# EAGLE design 7-segment (EAGLE 7.5.0)
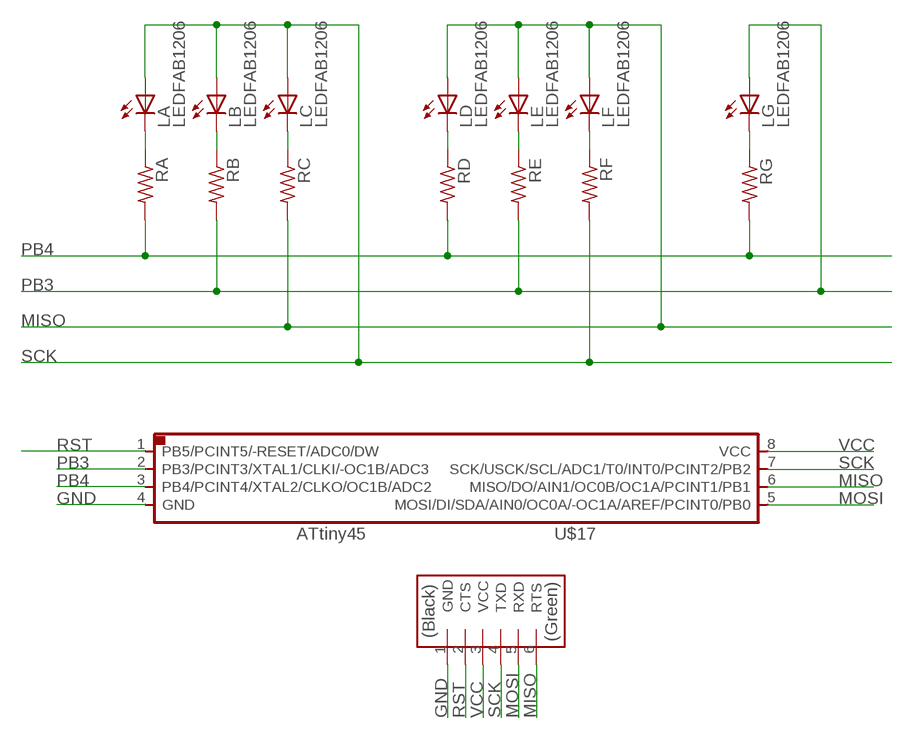
[diagram p0: schematic, sheet 1]

## Parts
LA  LEDFAB1206  [LED1206FAB]
LB  LEDFAB1206  [LED1206FAB]
LC  LEDFAB1206  [LED1206FAB]
LD  LEDFAB1206  [LED1206FAB]
LE  LEDFAB1206  [LED1206FAB]
LF  LEDFAB1206  [LED1206FAB]
LG  LEDFAB1206  [LED1206FAB]
RA  RES-US1206FAB  [R1206FAB]
RB  RES-US1206FAB  [R1206FAB]
RC  RES-US1206FAB  [R1206FAB]
RD  RES-US1206FAB  [R1206FAB]
RE  RES-US1206FAB  [R1206FAB]
RF  RES-US1206FAB  [R1206FAB]
RG  RES-US1206FAB  [R1206FAB]
U$3  FTDI-SMD-HEADER  [1X06SMD]
U$17  ATTINY45SI  [SOIC8]

## Nets
GND: U$3.1(GND) U$17.4(GND)
MISO: LD.1(A) LE.1(A) LF.1(A) RC.2 U$3.6(RTS) U$17.6(MISO/DO/AIN1/OC0B/OC1A/PCINT1/PB1)
MOSI: U$3.5(RXD) U$17.5(MOSI/DI/SDA/AIN0/OC0A/-OC1A/AREF/PCINT0/PB0)
N$2: LA.2(C) RA.1
N$4: LB.2(C) RB.1
N$5: LC.2(C) RC.1
N$6: LD.2(C) RD.1
N$7: LE.2(C) RE.1
N$8: LF.2(C) RF.1
N$11: LG.2(C) RG.1
PB3: LG.1(A) RB.2 RE.2 U$17.2(PB3/PCINT3/XTAL1/CLKI/-OC1B/ADC3)
PB4: RA.2 RD.2 RG.2 U$17.3(PB4/PCINT4/XTAL2/CLKO/OC1B/ADC2)
RST: U$3.2(CTS) U$17.1(PB5/PCINT5/-RESET/ADC0/DW)
SCK: LA.1(A) LB.1(A) LC.1(A) RF.2 U$3.4(TXD) U$17.7(SCK/USCK/SCL/ADC1/T0/INT0/PCINT2/PB2)
VCC: U$3.3(VCC) U$17.8(VCC)

## Library data of the parts
LA LB LC LD LE LF LG = fab:LED: LED
RA RB RC RD RE RF RG = fab:RES-US: Resistor (US Symbol) Variants with postfix FAB are widened to allow the routing of internal traces
U$3 = fab:FTDI-SMD-HEADER
U$17 = fab:ATTINY45

## Net classes
0 default: width 0.457 mm, clearance 1.626 mm

## Board
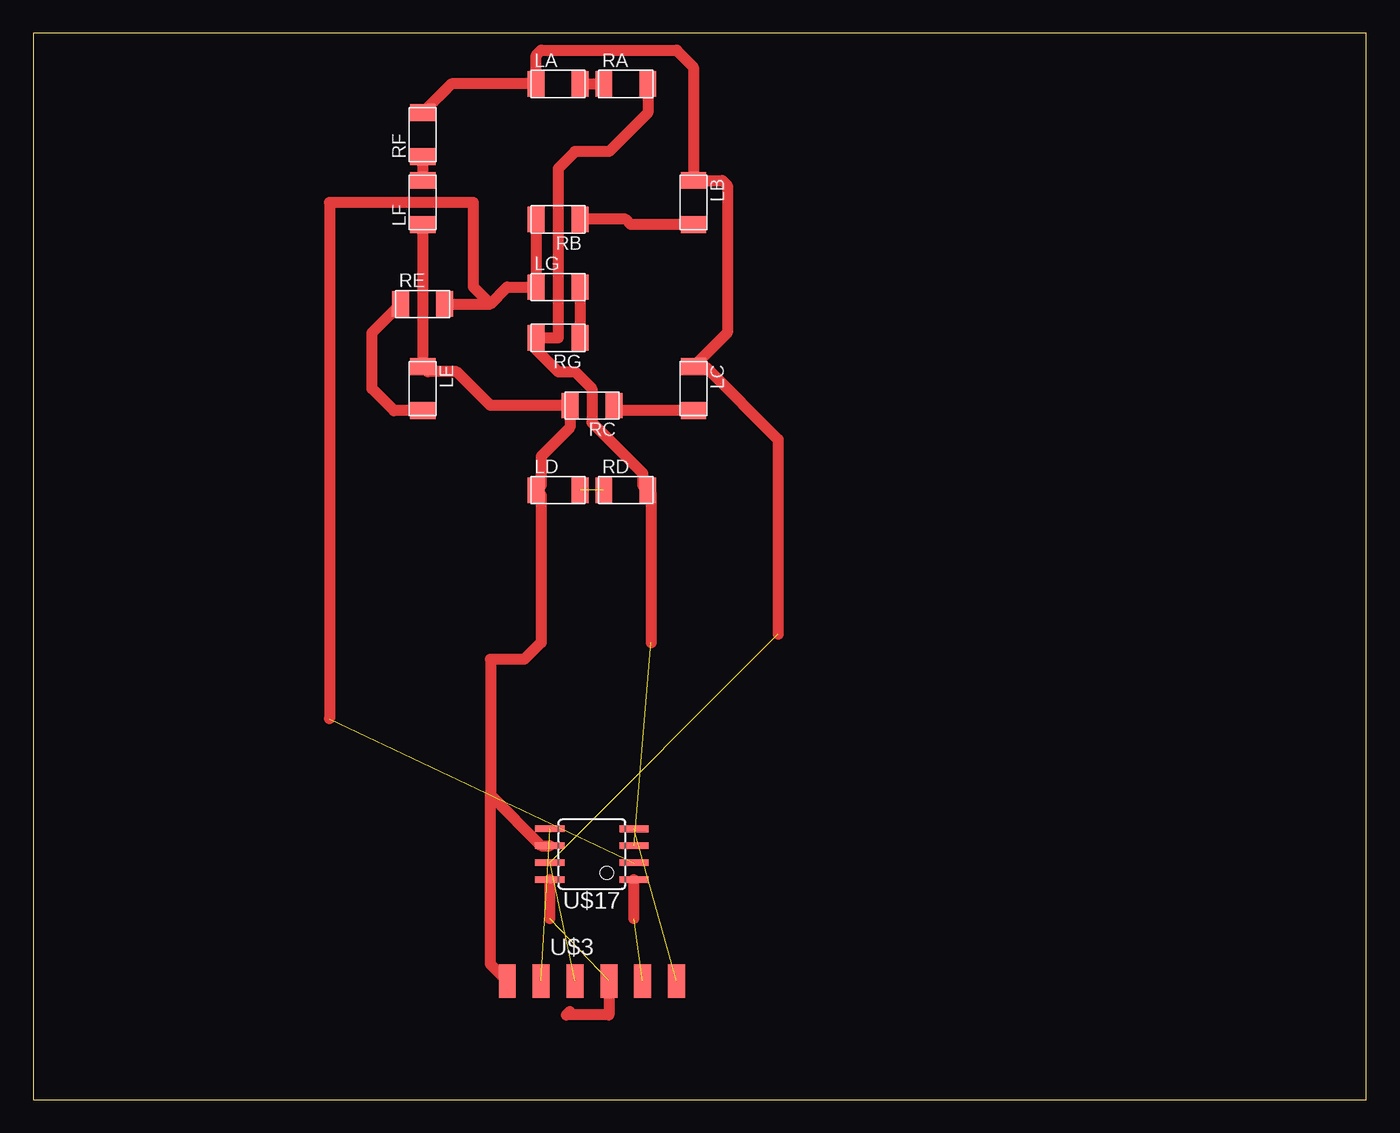
[diagram p1: board, top side]

Size 100 x 80 mm. Coordinates in mm from the lower left corner, seen from the top.
Outline: 0,0 100,0 100,80 0,80 0,0
Copper layers (1*16): Top 0.035mm / dielectric 1.5mm / Bottom 0.035mm
Design rules "fab": minimum track width 0.3mm, minimum drill 32mil, track to track 0.397mm, track to pad 0.397mm, pad to pad 0.397mm, via to via 0.397mm, smd to smd 0.315mm, copper to edge 40mil, drill to drill 16mil, minimum pad ring 10mil, minimum via ring 8mil, stop-mask expansion 4mil, vias tented up to drill 0mil, thermal gap 10mil

### Footprints (pad centres in the part's own frame; a part is rotated, then mirrored left to right if it is on the bottom)
LED1206FAB = smd 1.27 x 1.905: 1 -1.651,0; 2 1.651,0
R1206FAB = smd 1.27 x 1.905: 1 -1.651,0; 2 1.651,0
1X06SMD = smd 2.54 x 1.27: 1 0,6.35; 2 0,3.81; 3 0,1.27; 4 0,-1.27; 5 0,-3.81; 6 0,-6.35
SOIC8 = smd 0.5 x 2.2: 1 -1.905,-3.154; 2 -0.645,-3.154; 3 0.625,-3.154; 4 1.895,-3.154; 5 1.905,3.154; 6 0.635,3.154; 7 -0.635,3.154; 8 -1.905,3.154

### Placement (x,y rotation side)
LA  39.37,76.2 0 top
LB  49.53,67.31 270 top
LC  49.53,53.34 270 top
LD  39.37,45.72 0 top
LE  29.21,53.34 270 top
LF  29.21,67.31 90 top
LG  39.37,60.96 0 top
RA  44.45,76.2 0 top
RB  39.37,66.04 180 top
RC  41.91,52.07 180 top
RD  44.45,45.72 0 top
RE  29.21,59.69 0 top
RF  29.21,72.39 90 top
RG  39.37,57.15 180 top
U$3  41.91,8.89 270 top
U$17  41.91,18.41 90 top

### Tracks (layer width: path | path; a pad name or v marks a point on that pad's centre or on a via)
GND  (1 unrouted)
MISO
  Top 0.813: LF.1 LE.1 29.59,54.61 31.75,54.61 34.29,52.07 RC.2 40.26,50.42 38.1,48.26 38.1,46.1 LD.1 38.1,45.34 38.1,34.29 36.83,33.02 34.29,33.02 34.29,22.86 | 34.29,22.86 38.1,19.05 U$17.6 | U$3.6 34.29,10.16 34.29,22.86
MOSI  (1 unrouted)
N$2
  Top 0.813: LA.2 RA.1
N$4
  Top 0.813: LB.2 44.83,65.66 44.45,66.04 RB.1
N$5
  Top 0.813: LC.2 43.94,51.69 RC.1
N$6  (1 unrouted)
N$7
  Top 0.813: LE.2 27.05,51.69 25.4,53.34 25.4,57.53 RE.1
N$8
  Top 0.813: RF.1 LF.2
N$11
  Top 0.813: LG.2 RG.1
PB3  (1 unrouted)
  Top 0.813: RE.2 34.29,59.69 | 34.29,59.69 35.56,60.96 LG.1 RB.2 | 34.29,59.69 33.02,60.96 33.02,67.31 22.23,67.31 22.23,28.57
PB4  (1 unrouted)
  Top 0.813: RA.2 46.1,74.04 43.18,71.12 40.64,71.12 39.37,69.85 39.37,57.15 RG.2 37.72,56.26 39.37,54.61 40.64,54.61 41.91,53.34 41.91,50.8 45.72,46.99 45.72,46.1 RD.2 46.35,45.47 46.35,34.29
RST  (1 unrouted)
  Top 0.813: 45.06,13.57 U$17.1
SCK  (2 unrouted)
  Top 0.813: RF.2 31.37,76.2 LA.1 37.72,78.36 38.1,78.74 48.26,78.74 49.53,77.47 LB.1 51.69,68.96 52.07,68.58 52.07,57.53 LC.1 50.42,54.99 55.88,49.53 55.88,34.92
VCC  (1 unrouted)
  Top 0.813: U$3.3 43.18,6.35 40.01,6.35 40.26,6.6 | 38.76,13.57 U$17.8